# Altium schematic sheet Gyro.SchDoc
size A4 portrait; SheetNumber: 6; SheetTotal: 8
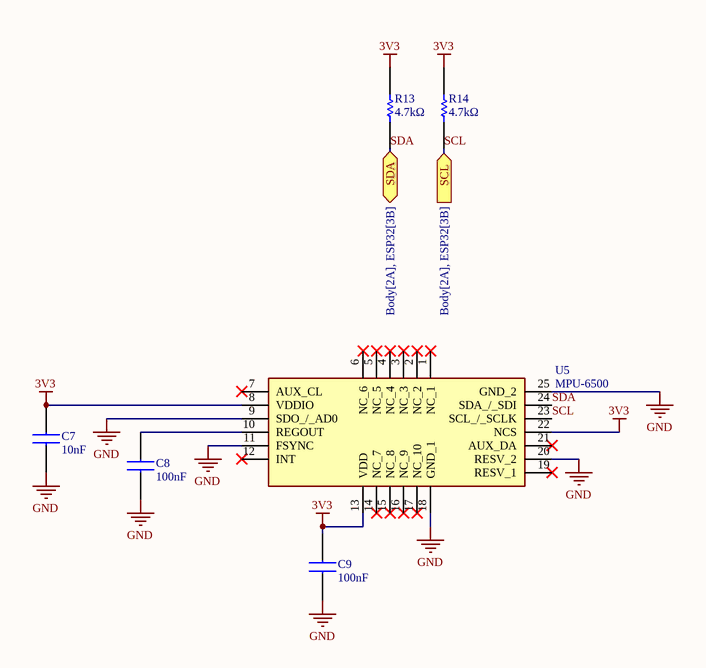
[diagram p0: Gyro.SchDoc]

## Parts
C7  value 10nF  [CAP0805]  (hidden comment: CL21B103KBANNNC)
C8  value 100nF  [CAP0805]  (hidden comment: CC0805KRX7R9BB104)
C9  value 100nF  [CAP0805]  (hidden comment: CC0805KRX7R9BB104)
R13  value 4.7kΩ  [RES0805]  (hidden comment: 0805W8F4701T5E)
R14  value 4.7kΩ  [RES0805]  (hidden comment: 0805W8F4701T5E)
U5  MPU-6500  [QFN-24_L3.0-W3.0-H0.9]

## Ports
SCL (in, see Body[2A], ESP32[3B]), SDA (bidir, see Body[2A], ESP32[3B])

## Nets
3V3: C7.1 C9.1 R13.2 R14.2 U5.8(VDDIO) U5.13(VDD) U5.22(NCS)
GND: C7.2 C8.1 C9.2 U5.9(SDO_/_AD0) U5.11(FSYNC) U5.18(GND_1) U5.20(RESV_2) U5.25(GND_2)
SCL: R14.1 U5.23(SCL_/_SCLK) ; port SCL
SDA: R13.1 U5.24(SDA_/_SDI) ; port SDA
NetC8_2: C8.2 U5.10(REGOUT)

Not connected (* = marked no-connect by the designer): U5 1(NC_1)* 2(NC_2)* 3(NC_3)* 4(NC_4)* 5(NC_5)* 6(NC_6)* 7(AUX_CL)* 12(INT)* 14(NC_7)* 15(NC_8)* 16(NC_9)* 17(NC_10)* 19(RESV_1)* 21(AUX_DA)*

## Library data of the parts
C7 = CL21B103KBANNNC: Multilayer Ceramic Capacitors MLCC - SMD/SMT 50 V 10nF X7R 0805 10%; Manufacturer_Name: YAGEO; Geometry.Height: 0.95mm; Manufacturer_Part_Number: CL21B103KBANNNC; Datasheet Link: https://wmsc.lcsc.com/wmsc/upload/file/pdf/v2/lcsc/2304140030_Samsung-Electro-Mechanics-CL21B103KBANNNC_C1710.pdf; LCSC: C1710
C8 C9 = CC0805KRX7R9BB104: Multilayer Ceramic Capacitors MLCC - SMD/SMT 50 V 0.1uF X7R 0805 10%; Manufacturer_Name: YAGEO; Geometry.Height: 0.95mm; Mouser Part Number: 603-CC805KRX7R9BB104; Mouser Price/Stock: https://www.mouser.co.uk/ProductDetail/YAGEO/CC0805KRX7R9BB104?qs=vTakOoo5QyLx0lXWgVtRhQ%3D%3D; Manufacturer_Part_Number: CC0805KRX7R9BB104; Datasheet Link: https://www.yageo.com/upload/media/product/productsearch/datasheet/mlcc/UPY-GPHC_X7R_6.3V-to-50V_20.pdf; LCSC: C49678
R13 R14 = 0805W8F4701T5E: 125mW Thick Film Resistors 150V ±100ppm/℃ ±1% 4.7kΩ 0805 Chip Resistor - Surface Mount ROHS; Manufacturer_Name: UNI-ROYAL; Geometry.Height: 0.95mm; Manufacturer_Part_Number: 0805W8F4701T5E; Datasheet Link: https://wmsc.lcsc.com/wmsc/upload/file/pdf/v2/lcsc/2206010200_UNI-ROYAL-Uniroyal-Elec-0805W8F4701T5E_C17673.pdf; LCSC: C17673
U5 = MPU-6500: IMUs - Inertial Measurement Units 6-Axis MEMS MotionTracking  Device with DMP; Manufacturer_Name: TDK; Geometry.Height: 0.95mm; LCSC: C50278; Part Number: MPU-6500; ComponentLink1Description: New link; ComponentLink1URL: https://product.tdk.com/system/files/dam/doc/product/sensor/mortion-inertial/imu/data_sheet/mpu-6500-datasheet2.pdf